# EAGLE schematic Core Schematic (EAGLE 9.6.2)
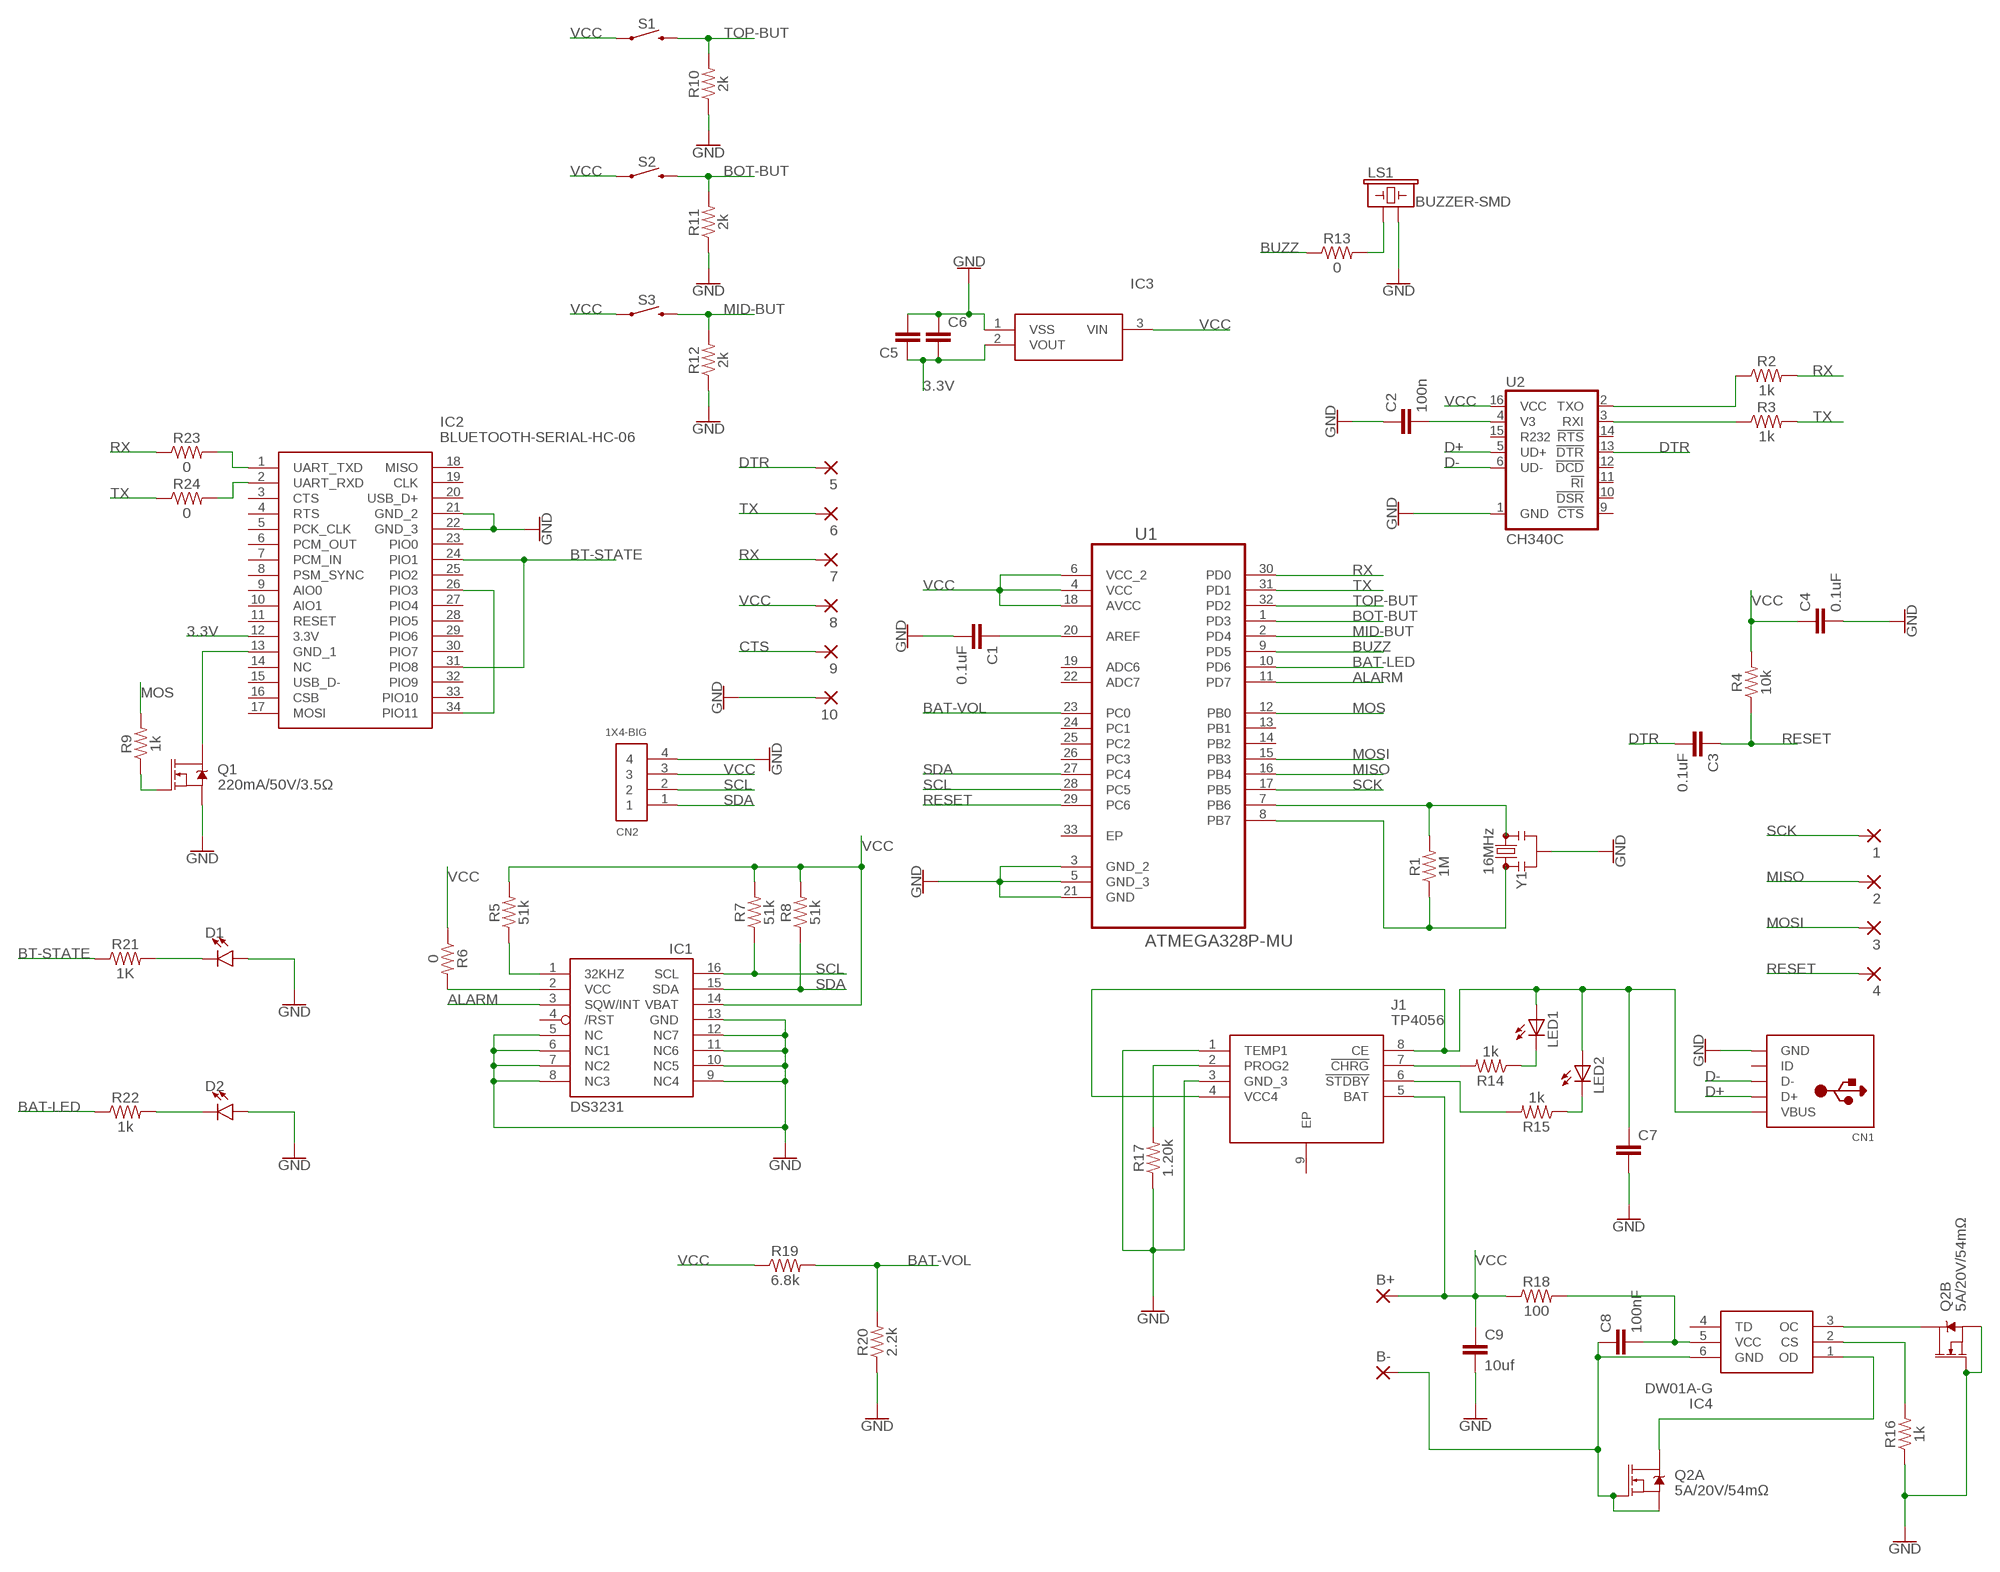
[diagram p0: schematic, sheet 1]

## Parts
1  SMD2  [SMD1,27-2,54]
2  SMD2  [SMD1,27-2,54]
3  SMD2  [SMD1,27-2,54]
4  SMD2  [SMD1,27-2,54]
5  SMD2  [SMD1,27-2,54]
6  SMD2  [SMD1,27-2,54]
7  SMD2  [SMD1,27-2,54]
8  SMD2  [SMD1,27-2,54]
9  SMD2  [SMD1,27-2,54]
10  SMD2  [SMD1,27-2,54]
B+  SMD2  [SMD1,27-2,54]
B-  SMD2  [SMD1,27-2,54]
C1  0.1uF  4.7PF-0603-50V-5%  [0603]
C2  100n  4.7PF-0603-50V-5%  [0603]
C3  0.1uF  4.7PF-0603-50V-5%  [0603]
C4  0.1uF  4.7PF-0603-50V-5%  [0603]
C5  4.7PF-0603-50V-5%  [0603]
C6  4.7PF-0603-50V-5%  [0603]
C7  4.7PF-0603-50V-5%  [0603]
C8  100nF  4.7PF-0603-50V-5%  [0603]
C9  10uf  4.7PF-0603-50V-5%  [0603]
CN1  USBMINIB  [USB-MINIB]
CN2  1X4-BIG  [1X04-BIG]
D1  LED0603  [LED-0603]
D2  LED0603  [LED-0603]
IC1  DS3231/SO  [SO16W]
IC2  BLUETOOTH-SERIAL-HC-06  [BLUETOOTHSERIALHC06]
IC3  XC6206P332MR  [SOT95P280X130-3N]
IC4  DW01A-G  [SOT95P280X135-6N]
J1  TP4056  [SOIC127P600X175-9N]
LED1  LEDCHIPLED_0805  [CHIPLED_0805]
LED2  LEDCHIPLED_0805  [CHIPLED_0805]
LS1  BUZZER-SMD  [BUZZER-CCV]
Q1  220mA/50V/3.5Ω  MOSFET-NCH-BSS138  [SOT23-3]
Q2  5A/20V/54mΩ  MOSFET_NCH_DUAL-FDMA1024NZ  [MICROFET_2X2]
R1  1M  1.20KOHM-0603-1/10W-1%  [0603]
R2  1k  1.20KOHM-0603-1/10W-1%  [0603]
R3  1k  1.20KOHM-0603-1/10W-1%  [0603]
R4  10k  1.20KOHM-0603-1/10W-1%  [0603]
R5  51k  1.20KOHM-0603-1/10W-1%  [0603]
R6  0  1.20KOHM-0603-1/10W-1%  [0603]
R7  51k  1.20KOHM-0603-1/10W-1%  [0603]
R8  51k  1.20KOHM-0603-1/10W-1%  [0603]
R9  1k  1.20KOHM-0603-1/10W-1%  [0603]
R10  2k  1.20KOHM-0603-1/10W-1%  [0603]
R11  2k  1.20KOHM-0603-1/10W-1%  [0603]
R12  2k  1.20KOHM-0603-1/10W-1%  [0603]
R13  0  1.20KOHM-0603-1/10W-1%  [0603]
R14  1k  1.20KOHM-0603-1/10W-1%  [0603]
R15  1k  1.20KOHM-0603-1/10W-1%  [0603]
R16  1k  1.20KOHM-0603-1/10W-1%  [0603]
R17  1.20k  1.20KOHM-0603-1/10W-1%  [0603]
R18  100  1.20KOHM-0603-1/10W-1%  [0603]
R19  6.8k  1.20KOHM-0603-1/10W-1%  [0603]
R20  2.2k  1.20KOHM-0603-1/10W-1%  [0603]
R21  1K  1.20KOHM-0603-1/10W-1%  [0603]
R22  1k  1.20KOHM-0603-1/10W-1%  [0603]
R23  0  1.20KOHM-0603-1/10W-1%  [0603]
R24  0  1.20KOHM-0603-1/10W-1%  [0603]
S1  MOMENTARY-SWITCH-SPST-SMD-6.0X3.5MM  [TACTILE_SWITCH_SMD_6.0X3.5MM]
S2  MOMENTARY-SWITCH-SPST-SMD-6.0X3.5MM  [TACTILE_SWITCH_SMD_6.0X3.5MM]
S3  MOMENTARY-SWITCH-SPST-SMD-6.0X3.5MM  [TACTILE_SWITCH_SMD_6.0X3.5MM]
U1  ATMEGA328P-MU  [QFN50P500X500X100-33N]
U2  CH340C  [SO016]
Y1  16MHz  RESONATOR-16MHZSMD_3.2X1.3  [RESONATOR-SMD-3.2X1.3]

## Nets
3.3V: C5.1 C6.2 IC2.12(3.3V) IC3.2(VOUT)
ALARM: IC1.3(SQW/INT) U1.11(PD7)
BAT-LED: R22.1 U1.10(PD6)
BAT-VOL: R19.2 R20.2 U1.23(PC0)
BOT-BUT: R11.2 S2.2 U1.1(PD3)
BT-STATE: IC2.24(PIO1) IC2.31(PIO8) R21.1
BUZZ: R13.1 U1.9(PD5)
CTS: 9.1(P)
D+: CN1.D+ U2.5(UD+)
D-: CN1.D- U2.6(UD-)
DTR: 5.1(P) C3.2 U2.13(!DTR)
GND: 10.1(P) C1.2 C2.1 C4.2 C5.2 C6.1 C7.2 C9.2 CN1.GND CN2.4 D1.A D2.A IC1.5(NC) IC1.6(NC1) IC1.7(NC2) IC1.8(NC3) IC1.9(NC4) IC1.10(NC5) IC1.11(NC6) IC1.12(NC7) IC1.13(GND) IC2.21(GND_2) IC2.22(GND_3) IC3.1(VSS) J1.1(TEMP1) J1.3(GND_3) LS1.- Q1.2(S) Q2.G2(B:G) Q2.S2(B:S) R10.1 R11.1 R12.1 R16.1 R17.1 R20.1 U1.3(GND_2) U1.5(GND_3) U1.21(GND) U2.1(GND) Y1.2
MID-BUT: R12.2 S3.2 U1.2(PD4)
MISO: 2.1(P) U1.16(PB4)
MOS: R9.2 U1.12(PB0)
MOSI: 3.1(P) U1.15(PB3)
N$1: C1.1 U1.20(AREF)
N$2: IC1.1(32KHZ) R5.1
N$3: R1.2 U1.7(PB6) Y1.3
N$4: R1.1 U1.8(PB7) Y1.1
N$5: IC1.2(VCC) R6.2
N$6: IC2.13(GND_1) Q1.3(D)
N$7: C2.2 U2.4(V3)
N$8: R3.1 U2.3(RXI)
N$9: Q1.1(G) R9.1
N$10: LS1.+ R13.2
N$11: R2.1 U2.2(TXO)
N$12: J1.6(!STDBY) R15.2
N$13: LED2.C R15.1
N$14: J1.7(!CHRG) R14.2
N$15: LED1.C R14.1
N$16: C7.1 CN1.VBUS J1.4(VCC4) J1.8(CE) LED1.A LED2.A
N$17: C8.2 IC4.5(VCC) R18.2
N$18: B-.1(P) C8.1 IC4.6(GND) Q2.G1(A:G) Q2.S1(A:S)
N$19: J1.2(PROG2) R17.2
N$20: D2.C R22.2
N$21: D1.C R21.2
N$22: IC2.26(PIO3) IC2.34(PIO11)
N$23: IC4.3(OC) Q2.D2(B:D) Q2.D2_2(B:D)
N$24: IC4.2(CS) R16.2
N$25: IC2.1(UART_TXD) R23.2
N$26: IC4.1(OD) Q2.D1(A:D) Q2.D1_2(A:D)
N$27: IC2.2(UART_RXD) R24.2
RESET: 4.1(P) C3.1 R4.1 U1.29(PC6)
RX: 7.1(P) R2.2 R23.1 U1.30(PD0)
SCK: 1.1(P) U1.17(PB5)
SCL: CN2.2 IC1.16(SCL) R7.1 U1.28(PC5)
SDA: CN2.1 IC1.15(SDA) R8.1 U1.27(PC4)
TOP-BUT: R10.2 S1.2 U1.32(PD2)
TX: 6.1(P) R3.2 R24.1 U1.31(PD1)
VCC: 8.1(P) B+.1(P) C4.1 C9.1 CN2.3 IC1.14(VBAT) IC3.3(VIN) J1.5(BAT) R4.2 R5.2 R6.1 R7.2 R8.2 R18.1 R19.1 S1.1 S2.1 S3.1 U1.4(VCC) U1.6(VCC_2) U1.18(AVCC) U2.16(VCC)
Unconnected: CN1.ID IC1.4(/RST) IC2.3(CTS) IC2.4(RTS) IC2.5(PCK_CLK) IC2.6(PCM_OUT) IC2.7(PCM_IN) IC2.8(PSM_SYNC) IC2.9(AIO0) IC2.10(AIO1) IC2.11(RESET) IC2.14(NC) IC2.15(USB_D-) IC2.16(CSB) IC2.17(MOSI) IC2.18(MISO) IC2.19(CLK) IC2.20(USB_D+) IC2.23(PIO0) IC2.25(PIO2) IC2.27(PIO4) IC2.28(PIO5) IC2.29(PIO6) IC2.30(PIO7) IC2.32(PIO9) IC2.33(PIO10) IC4.4(TD) J1.9(EP) U1.13(PB1) U1.14(PB2) U1.19(ADC6) U1.22(ADC7) U1.24(PC1) U1.25(PC2) U1.26(PC3) U1.33(EP) U2.9(!CTS) U2.10(!DSR) U2.11(!RI) U2.12(!DCD) U2.14(!RTS) U2.15(R232)

## Library data of the parts
1-10 B+ B- = wirepad:SMD2: SMD PAD
C1-C9 = SparkFun-Capacitors:4.7PF: 4.7pF ceramic capacitors A capacitor is a passive two-terminal electrical component used to store electrical energy temporarily in an electric field.; PROD_ID: CAP-07880; VALUE: 4.7pF
CN1 = adafruit:USB: USB Connectors USBMINIB - Surface Mount Female Mini-B USB Connector 4UConnector: 06564 By microbuilder.eu Thru-hole RA Female Mini-B USB Connector 4UConnector: 18732 By ladyada.net
CN2 = adafruit:1X4: 4-pin connector
D1 D2 = SparkFun-LED:LED: LED (Generic) Standard schematic elements and footprints for 5mm, 3mm, 1206, and 0603 sized LEDs. Generic LEDs with no color specified.
IC1 = adafruit:DS3231
IC2 = BLUETOOTH-SERIAL-HC-06:BLUETOOTH-SERIAL-HC-06: Bluetooth / 802.15.1 Modules BLUETOOTH-SERIAL-HC-06 Source: Datasheet <https://www.olimex.com/Products/Components/RF/BLUETOOTH-SERIAL-HC-06/resources/hc06.pdf>; DESCRIPTION: Bluetooth / 802.15.1 Modules BLUETOOTH-SERIAL-HC-06; HEIGHT: 2mm; MANUFACTURER_NAME: Olimex Ltd.; MANUFACTURER_PART_NUMBER: BLUETOOTH-SERIAL-HC-06; MOUSER_PART_NUMBER: 909-BLE-SERIAL-HC-06; MOUSER_PRICE-STOCK: https://www.mouser.co.uk/ProductDetail/Olimex-Ltd/BLUETOOTH-SERIAL-HC-06?qs=tMOYG%252Bw4%252BLzhaOkVjDuAYw%3D%3D
IC3 = XC6206P332MR:XC6206P332MR: Low ESR Cap.Compatible Postive Voltage Regulators Source: Datasheet <http://www.torexsemi.com/products/voltage_regulators/data/XC6206.pdf>; DESCRIPTION: Low ESR Cap.Compatible Postive Voltage Regulators; HEIGHT: 1.3mm; MANUFACTURER_NAME: Torex; MANUFACTURER_PART_NUMBER: XC6206P332MR
IC4 = DW01A-G:DW01A-G: One Cell Lithium-ion/Polymer Battery Protection IC Source: Datasheet <http://acoptex.com/uploads/DW01A.pdf>; DESCRIPTION: One Cell Lithium-ion/Polymer Battery Protection IC; HEIGHT: 1.35mm; MANUFACTURER_NAME: Fortune Semiconductor Corporation; MANUFACTURER_PART_NUMBER: DW01A-G
J1 = TP4056:TP4056: 1A Standalone Linear Li-lon Battery Charger, SOP-8 Source: Datasheet <https://dlnmh9ip6v2uc.cloudfront.net/datasheets/Prototyping/TP4056.pdf>; DESCRIPTION: 1A Standalone Linear Li-lon Battery Charger, SOP-8; HEIGHT: 1.75mm; MANUFACTURER_NAME: NanJing Top Power; MANUFACTURER_PART_NUMBER: TP4056
LED1 LED2 = adafruit:LED: LED OSRAM: - CHIPLED LG R971, LG N971, LY N971, LG Q971, LY Q971, LO R971, LY R971 LH N974, LH R974 LS Q976, LO Q976, LY Q976 LO Q996 - Hyper CHIPLED LW Q18S LB Q993, LB Q99A, LB R99A - SideLED LS A670, LO A670, LY A670, LG A670, LP A670 LB A673, LV A673, LT A673, LW A673 LH A674 LY A675 LS A676, LA A676, LO A676, LY A676, LW A676 LS A679, LY A679, LG A679 - Hyper Micro SIDELED® LS Y876, LA Y876, LO Y876, LY Y876 LT Y87S - SmartLED LW L88C, LW L88S LB L89C, LB L89S, LG L890 LS L89K, LO L89K, LY L89K LS L896, LA L896, LO L896, LY L896 - TOPLED LS T670, LO T670, LY T670, LG T670, LP T670 LSG T670, LSP T670, LSY T670, LOP T670, LYG T670 LG T671, LOG T671, LSG T671 LB T673, LV T673, LT T673, LW T673 LH T674 LS T676, LA T676, LO T676, LY T676, LB T676, LH T676, LSB T676, LW T676 LB T67C, LV T67C, LT T67C, LS T67K, LO T67K, LY T67K, LW E67C LS E67B, LA E67B, LO E67B, LY E67B, LB E67C, LV E67C, LT E67C LW T67C LS T679, LY T679, LG T679 LS T770, LO T770, LY T770, LG T770, LP T770 LB T773, LV T773, LT T773, LW T773 LH T774 LS E675, LA E675, LY E675, LS T675 LS T776, LA T776, LO T776, LY T776, LB T776 LHGB T686 LT T68C, LB T68C - Hyper Mini TOPLED® LB M676 - Mini TOPLED Santana® LG M470 LS M47K, LO M47K, LY M47K Source: http://www.osram.convergy.de/
LS1 = SparkFun-Electromechanical:BUZZER: Buzzer Small round buzzers that operate around the audible 2kHz range. You can use these as speakers to create simple music or user interfaces. Variant Overview: PTH - Mini Speaker - PC Mount 12mm 2.048kHz <https://www.sparkfun.com/products/7950> PTH_KIT - Mini Speaker - PC Mount 12mm 2.048kHz <https://www.sparkfun.com/products/7950> KIT simplifies soldering by adding stop mask to one side of the pads. PTH_NO_SILK - Mini Speaker - PC Mount 12mm 2.048kHz <https://www.sparkfun.com/products/7950> No silkscreen indicator of buzzer outline. PTH_KIT_NO_SILK - Mini Speaker - PC Mount 12mm 2.048kHz <https://www.sparkfun.com/products/7950> KIT package w/o silkscreen SMD - Buzzer Audio Magnetic (CCV-084B16) SMD buzzer used on, e.g. the LilyPad Buzzer <https://www.sparkfun.com/products/8463> and RFID USB Reader <https://www.sparkfun.com/products/9963>. SMD_KIT - Buzzer Audio Magnetic (CCV-084B16) SMD Buzzer with elongated pins to make soldering easier. Used on the SparkFun Simon Says - Surface Mount Soldering Kit <https://www.sparkfun.com/products/10935>.; PROD_ID: COMP-08568
Q1 = SparkFun-DiscreteSemi:MOSFET-NCH: N-channel MOSFETs Voltage controlled devices that allow control of high current outputs. SparkFun Products: SparkFun OpenScale <https://www.sparkfun.com/products/13261> SparkFun Digital Sandbox <https://www.sparkfun.com/products/12651> SparkFun Monster Moto Shield <https://www.sparkfun.com/products/10182> SparkFun MOSFET Power Controller <https://www.sparkfun.com/products/11214>; PROD_ID: TRANS-00830
Q2 = SparkFun-DiscreteSemi:MOSFET_NCH_DUAL: Dual N-Channel 30-VDS MOSFET Link to datasheet <https://www.fairchildsemi.com/datasheets/FD/FDMA1024NZ.pdf> SparkFun Products: SparkFun Mini FET Shield <https://www.sparkfun.com/products/9627>; PROD_ID: TRANS-09516
R1-R16 R18-R24 = SparkFun-Resistors:1.20KOHM: 1.20kΩ resistor A resistor is a passive two-terminal electrical component that implements electrical resistance as a circuit element. Resistors act to reduce current flow, and, at the same time, act to lower voltage levels within circuits. - Wikipedia; PROD_ID: RES-08413; VALUE: 1.20k
R17 = SparkFun-Resistors:1.20KOHM: 1.20kΩ resistor A resistor is a passive two-terminal electrical component that implements electrical resistance as a circuit element. Resistors act to reduce current flow, and, at the same time, act to lower voltage levels within circuits. - Wikipedia; PROD_ID: RES-08413
S1-S3 = SparkFun-Switches:MOMENTARY-SWITCH-SPST: Momentary Switch (Pushbutton) - SPST Normally-open (NO) SPST momentary switches (buttons, pushbuttons). Variants PTH-12MM - 12mm square, through-hole Momentary Pushbutton Switch - 12mm Square <https://www.sparkfun.com/products/9190> (COM-09190) PTH-6.0MM, PTH-6.0MM-KIT - 6.0mm square, through-hole Mini Pushbutton Switch <https://www.sparkfun.com/products/97> (COM-00097) KIT package intended for soldering kit's - only one side of pads' copper is exposed. PTH-RIGHT-ANGLE-KIT - Right-angle, through-hole Right Angle Tactile Button <https://www.sparkfun.com/products/10791> - Used on SparkFun BigTime Watch Kit <https://www.sparkfun.com/products/11734> SMD-12MM - 12mm square, surface-mount Tactile Button - SMD (12mm) <https://www.sparkfun.com/products/12993> (COM-12993) Used on SparkFun PicoBoard <https://www.sparkfun.com/products/11888> SMD-4.5MM - 4.5mm Square Trackball Switch Used on SparkFun Blackberry Trackballer Breakout <https://www.sparkfun.com/products/13169> SMD-4.6MMX2.8MM - 4.60mm x 2.80mm, surface mount Used on SparkFun SAMD21 Mini Breakout <https://www.sparkfun.com/products/13664> SMD-5.2MM, SMD-5.2-REDUNDANT - 5.2mm square, surface-mount Mini Pushbutton Switch - SMD <https://www.sparkfun.com/products/8720> (COM-08720) Used on Arduino Pro Mini <https://www.sparkfun.com/products/11114> REDUNDANT package connects both switch circuits together SMD-6.0X3.5MM - 6.0 x 3.5mm, surface mount Momentary Reset Switch SMD <https://www.sparkfun.com/products/8229> (COM-08229) SMD-6.2MM-TALL - 6.2mm square, surface mount Tactile Button - SMD (6mm) <https://www.sparkfun.com/products/12992> Used on SparkFun Digital Sandbox <https://www.sparkfun.com/products/12651> SMD-RIGHT-ANGLE - Right-angle, surface mount Used on SparkFun Block for Intel® Edison - Arduino <https://www.sparkfun.com/products/13036>; PROD_ID: SWCH-14278; SF_SKU: COM-08229
U1 = Ava:ATMEGA328P-MU: Programmable Flash; MPN: ATMEGA328P-MU; OC_FARNELL: 1748522; OC_NEWARK: 26R2526; PACKAGE: QFN-32; SUPPLIER: Atmel
U2 = SparkFun-IC-Comms:CH340C; PROD_ID: IC-14038
Y1 = SparkFun-Clocks:RESONATOR-16MHZ: 16MHz Resonator Digikey Example <http://www.digikey.com/product-detail/en/murata-electronics-north-america/CSTCE16M0V53-R0/490-1198-1-ND/584635> Frequency: 16MHz Frequency Stability: ±0.3% Frequency Tolerance: ±0.5% Capacitance: 15pF SparkFun Products SparkFun OpenLog <https://www.sparkfun.com/products/13712> SparkFun MicroView - OLED Arduino Module <https://www.sparkfun.com/products/12923>; PROD_ID: XTAL-08900